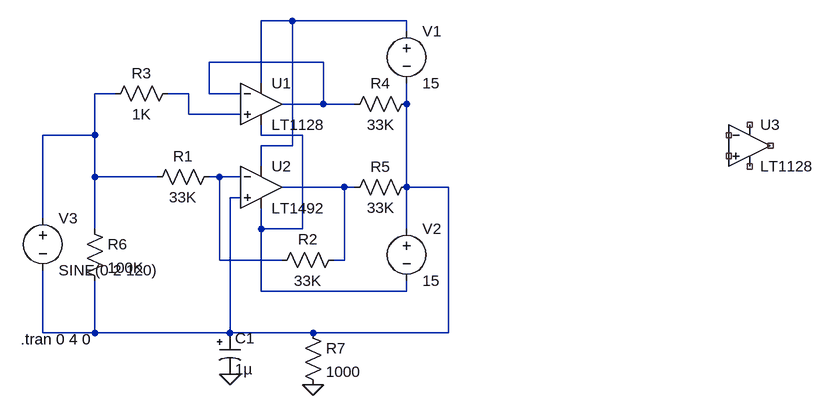
[diagram p0: schematic Draft5.asc]
Draft5.asc, the LTspice schematic file:
Version 4
SHEET 1 980 680
WIRE 160 0 112 0
WIRE 336 0 160 0
WIRE 336 16 336 0
WIRE 208 64 32 64
WIRE 112 96 112 0
WIRE -112 112 -144 112
WIRE 0 112 -32 112
WIRE 32 112 32 64
WIRE 80 112 32 112
WIRE 208 128 208 64
WIRE 208 128 144 128
WIRE 256 128 208 128
WIRE 336 128 336 96
WIRE 0 144 0 112
WIRE 80 144 0 144
WIRE -144 176 -144 112
WIRE -144 176 -224 176
WIRE 112 176 112 160
WIRE 176 176 112 176
WIRE 160 192 160 0
WIRE 160 192 112 192
WIRE 112 224 112 192
WIRE -144 240 -144 176
WIRE -48 240 -144 240
WIRE 48 240 32 240
WIRE 80 240 48 240
WIRE 240 256 144 256
WIRE 256 256 240 256
WIRE 336 256 336 128
WIRE 400 256 336 256
WIRE 80 272 64 272
WIRE -224 304 -224 176
WIRE -144 320 -144 240
WIRE 112 320 112 288
WIRE 176 320 176 176
WIRE 176 320 112 320
WIRE 336 320 336 256
WIRE 48 368 48 240
WIRE 144 368 48 368
WIRE 240 368 240 256
WIRE 240 368 224 368
WIRE 112 416 112 320
WIRE 336 416 336 400
WIRE 336 416 112 416
WIRE -224 480 -224 384
WIRE -144 480 -144 400
WIRE -144 480 -224 480
WIRE 64 480 64 272
WIRE 64 480 -144 480
WIRE 192 480 64 480
WIRE 400 480 400 256
WIRE 400 480 192 480
FLAG 64 544 0
FLAG 192 560 0
SYMBOL Opamps\\LT1128 112 64 R0
SYMATTR InstName U1
SYMBOL Opamps\\LT1128 864 128 R0
SYMATTR InstName U3
SYMBOL voltage 336 0 R0
WINDOW 123 0 0 Left 2
WINDOW 39 0 0 Left 2
SYMATTR InstName V1
SYMATTR Value 15
SYMBOL voltage 336 304 R0
WINDOW 123 0 0 Left 2
WINDOW 39 0 0 Left 2
SYMATTR InstName V2
SYMATTR Value 15
SYMBOL res 48 224 R90
WINDOW 0 0 56 VBottom 2
WINDOW 3 32 56 VTop 2
SYMATTR InstName R1
SYMATTR Value 33K
SYMBOL res 240 352 R90
WINDOW 0 0 56 VBottom 2
WINDOW 3 32 56 VTop 2
SYMATTR InstName R2
SYMATTR Value 33K
SYMBOL res -16 96 R90
WINDOW 0 0 56 VBottom 2
WINDOW 3 32 56 VTop 2
SYMATTR InstName R3
SYMATTR Value 1K
SYMBOL res 352 112 R90
WINDOW 0 0 56 VBottom 2
WINDOW 3 32 56 VTop 2
SYMATTR InstName R4
SYMATTR Value 33K
SYMBOL res 352 240 R90
WINDOW 0 0 56 VBottom 2
WINDOW 3 32 56 VTop 2
SYMATTR InstName R5
SYMATTR Value 33K
SYMBOL res -160 304 R0
SYMATTR InstName R6
SYMATTR Value 100K
SYMBOL voltage -224 288 R0
WINDOW 123 0 0 Left 2
WINDOW 39 0 0 Left 2
SYMATTR InstName V3
SYMATTR Value SINE(0 2 120)
SYMBOL polcap 48 480 R0
WINDOW 3 24 56 Left 2
SYMATTR InstName C1
SYMATTR Value 1µ
SYMATTR Description Capacitor
SYMATTR Type cap
SYMATTR SpiceLine V=16 Irms=0 Rser=11 Lser=0 mfg="AVX" pn="TAJA105K016" type="Tantalum"
SYMBOL Opamps\\LT1492 112 192 R0
SYMATTR InstName U2
SYMBOL res 176 464 R0
SYMATTR InstName R7
SYMATTR Value 1000
TEXT -258 490 Left 2 !.tran 0 4 0

The netlist it stands for:
* Draft5.asc
XU1 N004 N002 N001 N006 N002 LT1128  ; pins In+ In- V+ V- OUT
XU3 NC_01 NC_02 NC_03 NC_04 NC_05 LT1128  ; pins In+ In- V+ V- OUT
V1 N001 N005 15
V2 N005 N006 15
R1 N007 N003 33K
R2 N008 N007 33K
R3 N004 N003 1K
R4 N005 N002 33K
R5 N005 N008 33K
R6 N003 N005 100K
V3 N003 N005 SINE(0 2 120)
C1 N005 0 1µ V=16 Irms=0 Rser=11 Lser=0 mfg="AVX" pn="TAJA105K016" type="Tantalum"
XU2 N005 N007 N001 N006 N008 LT1492  ; pins In+ In- V+ V- OUT
R7 N005 0 1000
.tran 0 4 0
.lib LTC.lib
.backanno
.end